# Altium project Button-Board.PrjPcb
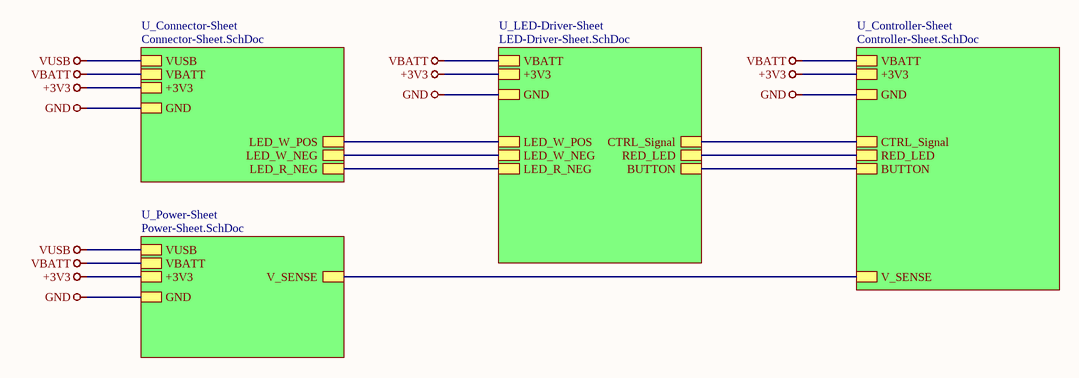
[diagram p0: Top-Sheet.SchDoc]
5 sheets, 41 parts. Net scope: hierarchical (ports join the sheet entries above them; power ports are global).
Board file: PCB_Button_Board.PcbDoc
Sheets:
  Top-Sheet.SchDoc
    U_Connector-Sheet = Connector-Sheet.SchDoc
    U_Controller-Sheet = Controller-Sheet.SchDoc
    U_LED-Driver-Sheet = LED-Driver-Sheet.SchDoc
    U_Power-Sheet = Power-Sheet.SchDoc

## Sheet Top-Sheet.SchDoc
size A; DocumentNumber: 1; SheetNumber: 1; SheetTotal: 5

### Sub-sheets
U_Connector-Sheet = Connector-Sheet.SchDoc: VUSB, LED_W_POS, LED_W_NEG, LED_R_NEG, GND, +3V3, VBATT
U_Controller-Sheet = Controller-Sheet.SchDoc: GND, +3V3, RED_LED, CTRL_Signal, BUTTON, VBATT, V_SENSE
U_LED-Driver-Sheet = LED-Driver-Sheet.SchDoc: GND, +3V3, RED_LED, CTRL_Signal, BUTTON, VBATT, LED_W_POS, LED_W_NEG, LED_R_NEG
U_Power-Sheet = Power-Sheet.SchDoc: GND, +3V3, VUSB, VBATT, V_SENSE

### Nets
+3V3: sheet U_Connector-Sheet/+3V3, sheet U_Controller-Sheet/+3V3, sheet U_LED-Driver-Sheet/+3V3, sheet U_Power-Sheet/+3V3
GND: sheet U_Connector-Sheet/GND, sheet U_Controller-Sheet/GND, sheet U_LED-Driver-Sheet/GND, sheet U_Power-Sheet/GND
VBATT: sheet U_Connector-Sheet/VBATT, sheet U_Controller-Sheet/VBATT, sheet U_LED-Driver-Sheet/VBATT, sheet U_Power-Sheet/VBATT
VUSB: sheet U_Connector-Sheet/VUSB, sheet U_Power-Sheet/VUSB
BUTTON: sheet U_Controller-Sheet/BUTTON, sheet U_LED-Driver-Sheet/BUTTON
CTRL_Signal: sheet U_Controller-Sheet/CTRL_Signal, sheet U_LED-Driver-Sheet/CTRL_Signal
LED_R_NEG: sheet U_Connector-Sheet/LED_R_NEG, sheet U_LED-Driver-Sheet/LED_R_NEG
LED_W_NEG: sheet U_Connector-Sheet/LED_W_NEG, sheet U_LED-Driver-Sheet/LED_W_NEG
LED_W_POS: sheet U_Connector-Sheet/LED_W_POS, sheet U_LED-Driver-Sheet/LED_W_POS
RED_LED: sheet U_Controller-Sheet/RED_LED, sheet U_LED-Driver-Sheet/RED_LED
V_SENSE: sheet U_Controller-Sheet/V_SENSE, sheet U_Power-Sheet/V_SENSE

## Sheet Connector-Sheet.SchDoc
size A; DocumentNumber: 5; SheetNumber: 5; SheetTotal: 5
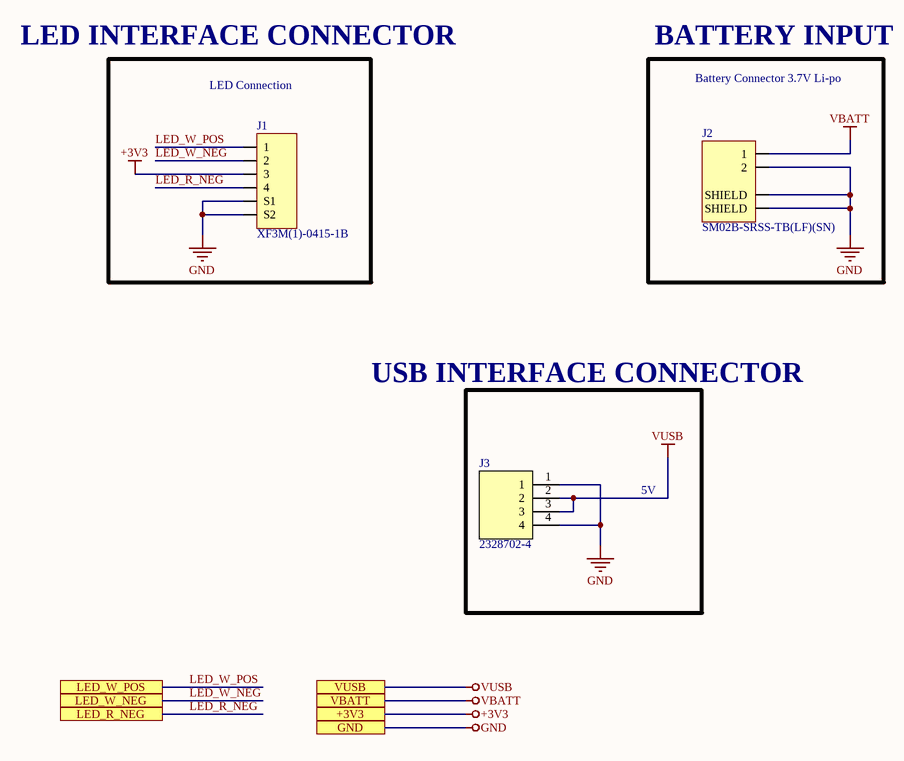
[diagram p1: Connector-Sheet.SchDoc]

### Parts
J1  XF3M(1)-0415-1B  [XF3M(1)-0415-1B]
J2  SM02B-SRSS-TB(LF)(SN)  [SM02B-SRSS-TB(LF)(SN)]
J3  2328702-4  [TE_2328702-4]

### Blocks framed on the sheet
LED Connection: J1
BATTERY INPUT: J2
5V: J3

### Ports
+3V3 (see Top-Sheet[1A], Controller-Sheet[2D], LED-Driver-Sheet[2D], Power-Sheet[2D]), GND (see Top-Sheet[1B], Controller-Sheet[2D], LED-Driver-Sheet[2D], Power-Sheet[2D]), LED_R_NEG (see Top-Sheet[2B], LED-Driver-Sheet[1D]), LED_W_NEG (see Top-Sheet[2B], LED-Driver-Sheet[1D]), LED_W_POS (see Top-Sheet[2B], LED-Driver-Sheet[1D]), VBATT (see Top-Sheet[1A], Controller-Sheet[2D], LED-Driver-Sheet[2D], Power-Sheet[2D]), VUSB (see Top-Sheet[1A], Power-Sheet[2D])

### Nets
+3V3: J1.3 ; port +3V3
GND: J1.S1 J1.S2 J2.2 J2.3(SHIELD) J2.4(SHIELD) J3.1 J3.4 ; port GND
VBATT: J2.1 ; port VBATT
VUSB: J3.2 J3.3 ; port VUSB
LED_R_NEG: J1.4 ; port LED_R_NEG
LED_W_NEG: J1.2 ; port LED_W_NEG
LED_W_POS: J1.1 ; port LED_W_POS

### Notes on the sheet
- LED INTERFACE CONNECTOR
- Battery Connector 3.7V Li-po
- USB INTERFACE CONNECTOR

### Library data of the parts
J1 = XF3M(1)-0415-1B: 4 Position FFC, FPC Connector Contacts, Top and Bottom 0.039" (1.00mm) Surface Mount, Right Angle; Manufacturer: Omron Electronics Inc-EMC Div; Item Type: FPC-1mm; Manufacturer Part Number: XF3M(1)-0415-1B; Digikey Part Number: OR1210CT-ND; ComponentLink1Description: Digikey Link; ComponentLink1URL: https://www.digikey.com/en/products/detail/omron-electronics-inc-emc-div/XF3M-1-0415-1B/4695932; Package: 1mm FPC
J2 = SM02B-SRSS-TB(LF)(SN): Connector Header Surface Mount, Right Angle 2 position 0.039 _1.00mm_; Manufacturer Part NUmber: SM02B-SRSS-TB_LF__SN_; Manufacturer: JST Sales; SnapEDA_Link: https://www.snapeda.com/parts/SM02B-SRSS-TB%28LF%29%28SN%29/JST%20Sales%20America%20Inc./view-part/447499/?ref=snap; Price: None; Value: *; Availability: Unavailable; Package: None; Digikey Part Number: 455-SM02B-SRSS-TBDKR-ND; ComponentLink1Description: Digikey Link; ComponentLink1URL: https://www.digikey.com/en/products/detail/jst-sales-america-inc/SM02B-SRSS-TB/926708?s=N4IgTCBcDaIMoFkAMYBCBaOAlOd0BVUQBdAXyA
J3 = 2328702-4: 4 Position FPC Connector Contacts, Top and Bottom 0.020 (0.50mm) Surface Mount, Right Angle; MF: TE Connectivity AMP Connectors; Package: None; Price: None; Check_prices: https://www.snapeda.com/parts/2328702-4/TE+Connectivity/view-part/?ref=eda; Value: *; SnapEDA_Link: https://www.snapeda.com/parts/2328702-4/TE+Connectivity/view-part/?ref=snap; MP: 2328702-4; Availability: In Stock; Purchase-URL: https://pricing.snapeda.com/search?q=2328702-4&ref=eda

## Sheet Controller-Sheet.SchDoc
size A; DocumentNumber: 3; SheetNumber: 3; SheetTotal: 5
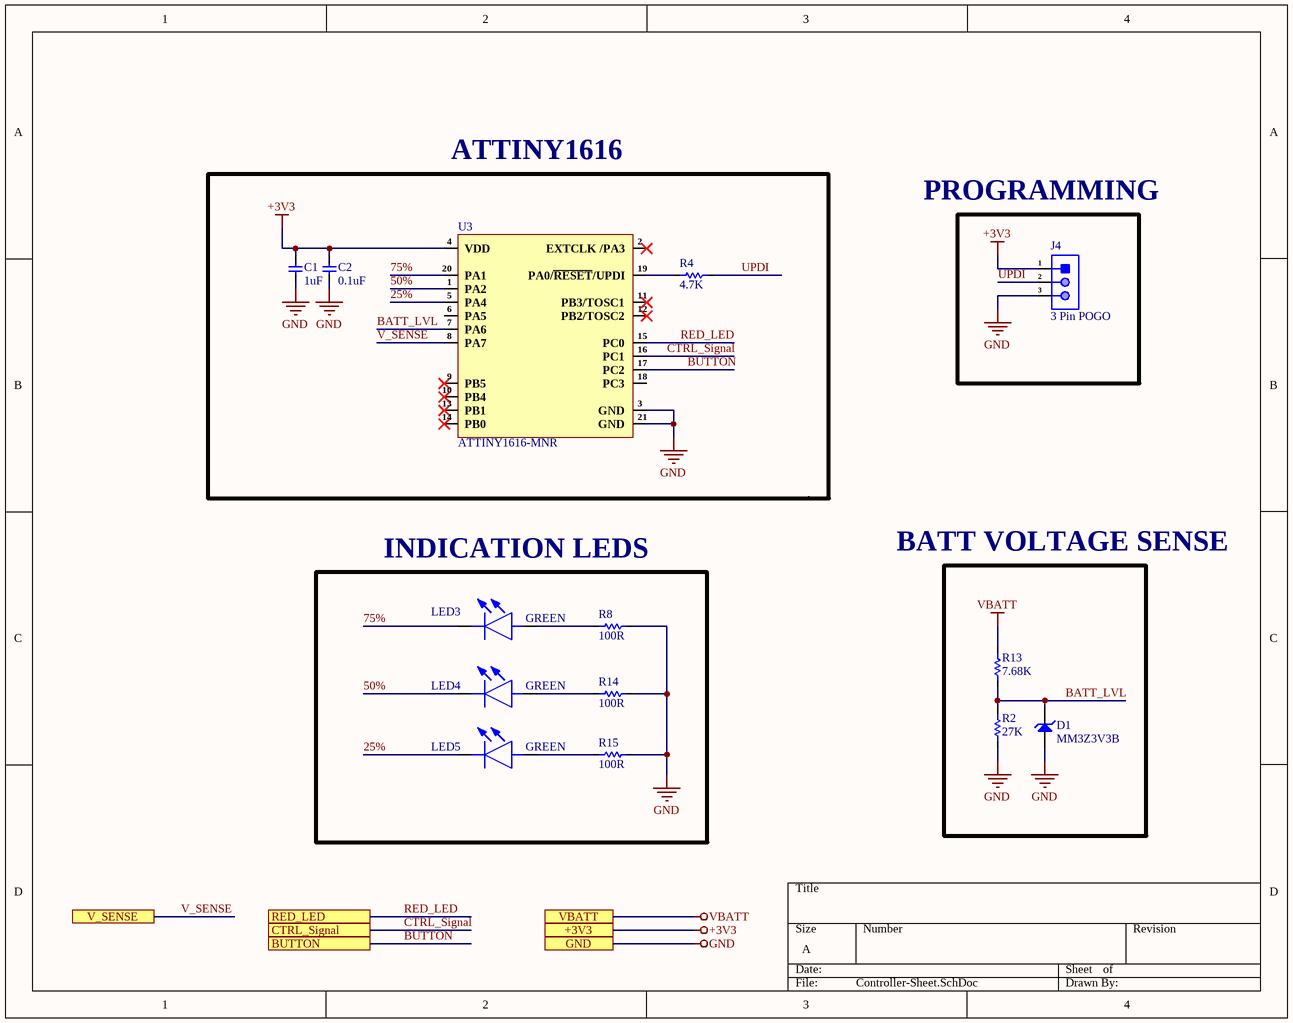
[diagram p2: Controller-Sheet.SchDoc]

### Parts
C1  1uF  [Cap-0402]
C2  0.1uF  [Cap-0402]
D1  MM3Z3V3B  [SOD323F]
J4  3 Pin POGO  [3 Pin POGO]
LED3  GREEN  [150060GS75000]
LED4  GREEN  [150060GS75000]
LED5  GREEN  [150060GS75000]
R2  27K  [Res-0402]
R4  4.7K  [Res-0402]
R8  100R  [Res-0402]
R13  7.68K  [Res-0402]
R14  100R  [Res-0402]
R15  100R  [Res-0402]
U3  ATTINY1616-MNR  [20-VQFN (3x3)]

### Blocks framed on the sheet
INDICATION LEDS: LED3-LED5 R8 R14 R15

### Ports
+3V3 (see Top-Sheet[3A], Connector-Sheet[2D], LED-Driver-Sheet[2D], Power-Sheet[2D]), BUTTON (see Top-Sheet[3B], LED-Driver-Sheet[1D]), CTRL_Signal (see Top-Sheet[3B], LED-Driver-Sheet[1D]), GND (see Top-Sheet[3A], Connector-Sheet[2D], LED-Driver-Sheet[2D], Power-Sheet[2D]), RED_LED (see Top-Sheet[3B], LED-Driver-Sheet[1D]), V_SENSE (see Top-Sheet[3B], Power-Sheet[1D]), VBATT (see Top-Sheet[3A], Connector-Sheet[2D], LED-Driver-Sheet[2D], Power-Sheet[2D])

### Nets
+3V3: C1.2 C2.2 J4.1 U3.4(VDD) ; port +3V3
GND: C1.1 C2.1 D1.1(A) J4.3 R2.1 R8.2 R14.2 R15.2 U3.3(GND) U3.21(GND) ; port GND
VBATT: R13.2 ; port VBATT
25%: LED5.1 U3.5(PA4)
50%: LED4.1 U3.1(PA2)
75%: LED3.1 U3.20(PA1)
BATT_LVL: D1.2(K) R2.2 R13.1 U3.7(PA6)
BUTTON: U3.17(PC2) ; port BUTTON
CTRL_Signal: U3.16(PC1) ; port CTRL_Signal
RED_LED: U3.15(PC0) ; port RED_LED
UPDI: J4.2 R4.2
V_SENSE: U3.8(PA7) ; port V_SENSE
NetLED3_2: LED3.2 R8.1
NetLED4_2: LED4.2 R14.1
NetLED5_2: LED5.2 R15.1
NetR4_1: R4.1 U3.19(PA0/~{RESET}/UPDI)

Not connected (* = marked no-connect by the designer): U3 2(EXTCLK_/PA3)* 6(PA5) 9(PB5)* 10(PB4)* 11(PB3/TOSC1)* 12(PB2/TOSC2)* 13(PB1)* 14(PB0)* 18(PC3)

### Notes on the sheet
- ATTINY1616
- PROGRAMMING
- BATT VOLTAGE SENSE

### Library data of the parts
C1 = GRM033R60J105MEA2D: 1 µF ±20% 6.3V Ceramic Capacitor X5R 0201 (0603 Metric); Manufacturer: Murata Electronics; Manufacturer Part Number: GRM033R60J105MEA2D; Digikey Part Number: 490-7229-6-ND; Item Type: Capacitor; Package: 0201; ComponentLink1Description: Digikey Link; ComponentLink1URL: https://www.digikey.com/en/products/detail/murata-electronics/GRM033R60J105MEA2D/4213369
C2 = GRM155R71C104KA88J: 0.1 µF ±10% 16V Ceramic Capacitor X7R 0402 (1005 Metric); Manufacturer: Murata Electronics; Manufacturer Part Number: GRM155R71C104KA88J; Digikey Part Number: 490-6328-6-ND; Item Type: Capacitor; Package: 0402; ComponentLink1Description: Digikey Link; ComponentLink1URL: https://www.digikey.com/en/products/detail/murata-electronics/GRM155R71C104KA88J/2610892
D1 = MM3Z3V3B: DIODE ZENER 3.3V 200MW SOD323F; Manufacturer: ON Semiconductor / Fairchild; Forward Voltage: 1V; Tolerance: 2%; Impedance: 89R; Max Reverse Leakage Current: 4.5uA; Test Current: 5mA; Element Configuration: Single; Supplier 1: Digi-Key; Manufacturer Part Number: MM3Z3V3B; Stock 1: 473644; Pricing 1: 1=0.22, 10=0.18, 100=0.0956, 500=0.06288, 1000=0.04276 (USD); Mount: Surface Mount; Number of Pins: 2; Weight: 0.0276g; Min Operating Temperature: -65°C; Max Operating Temperature: 150°C; Packaging: Tape and Reel; Package Quantity: 1; Max Power Dissipation: 200mW; Zener Voltage: 3.3V; Voltage Tolerance: 2%; Power Dissipation: 200mW; Working Voltage: 3.3V; Peak Reverse Current: 4.5uA; Length: 1.3mm; Height: 1mm; Width: 1.7mm; Radiation Hardening: No; REACH SVHC: No SVHC; Lead Free: Lead Free; ComponentLink1URL: http://www.onsemi.com/pub/Collateral/MM3Z9V1B-D.pdf?src-supplier=Digi-Key; ComponentLink1Description: http://www.onsemi.com/pub/Collateral/MM3Z9V1B-D.pdf?src-supplier=Digi-Key; ComponentLink2URL: http://www.mouser.com/ds/2/149/MM3Z3V3B-187166.pdf?src-supplier=Mouser; ComponentLink2Description: http://www.mouser.com/ds/2/149/MM3Z3V3B-187166.pdf?src-supplier=Mouser; ComponentLink3URL: https://www.fairchildsemi.com/datasheets/MM/MM3Z9V1B.pdf?src-supplier=Avnet; ComponentLink3Description: https://www.fairchildsemi.com/datasheets/MM/MM3Z9V1B.pdf?src-supplier=Avnet; ComponentLink4URL: http://www.farnell.com/datasheets/1706525.pdf?src-supplier=Element14; ComponentLink4Description: http://www.farnell.com/datasheets/1706525.pdf?src-supplier=Element14; Supplier Part Number 1: MM3Z3V3BCT-ND; Digikey Part Number: MM3Z3V3BDKR-ND; Item Type: Diode; ComponentLink5Description: Digikey Link; ComponentLink5URL: https://www.digikey.com/en/products/detail/onsemi/MM3Z3V3B/1626765?s=N4IgTCBcDaILJwMwC1EDVECEQF0C%2BQA
J4 = 68000-103HLF: CONN HEADER VERT 3POS 2.54MM; Item Type: Male Header; Number of Positions: 3; Current Rating: 3A; Insulation Resistance: 5GR; Voltage Rating: 1.5kV; Contact Post Length: 2.41mm; LCSC Part Number: C168677; ComponentLink1Description: LCSC; Supplier: Avnet; Supplier Part Number: 88K1775; RoHS: No; Category: Headers and Wire Housings; Stock: 2805; Pricing: 1=0.395, 10=0.31, 25=0.29, 50=0.27, 100=0.25 (USD); Contact Plating: Gold,GXT; Contact Material: Bronze; Housing Material: Thermoplastic; Housing Color: Black; Min Operating Temperature: -65°C; Max Operating Temperature: 125°C; Number of Rows: 1; Termination: Through Hole; Packaging: Bulk; Number of Contacts: 3; Contact Gender: Male; Orientation: Straight; Max Voltage Rating (AC): 1.5kV; Package Quantity: 100; Series: 68000; Length: 7.62mm; Pitch: 2.54mm; Contact Mating Length: 5.84mm; Depth: 2.41mm; Radiation Hardening: No; Flammability Rating: UL94 V-0; Reach SVHC Compliant: No; ComponentLink2URL: https://datasheet.ciiva.com/46392/1914865-46392021.pdf?src-supplier=Element14; ComponentLink2Description: https://datasheet.ciiva.com/46392/1914865-46392021.pdf?src-supplier=Element14; Digikey Part Number: 609-3461-ND; ComponentLink3Description: Digikey Link; ComponentLink3URL: https://www.digikey.com/en/products/detail/amphenol-cs-fci/68000-103HLF/2023309?s=N4IgTCBcDaIGwA4AMKC0BGJBmAEgGQDEQBdAXyA; Manufacturer Part Number: 68000-103HLF
LED3-LED5 = 150060GS75000: Green 520nm LED Indication - Discrete 3.2V 0603 (1608 Metric); Manufacturer: Würth Elektronik; Manufacturer Part Number: 150060GS75000; Supplier Part Number: 732-4971-6-ND; Item Type: LED; ComponentLink1Description: Digikey Link; ComponentLink1URL: https://www.digikey.com/en/products/detail/w%C3%BCrth-elektronik/150060GS75000/4489898; Package: 0603; Digikey Part Number: 732-4971-6-ND
R2 = RC0402FR-0727KL: 27 kOhms ±1% 0.063W, 1/16W Chip Resistor 0402 (1005 Metric) Moisture Resistant Thick Film; Manufacturer: YAGEO; Manufacturer Part Number: RC0402FR-0727KL; ComponentLink1Description: New link; ComponentLink1URL: *; Digikey Part Number: 311-27.0KLRDKR-ND; Item Type: Resistor; Package: 0402
R4 = RC0402FR-074K7L: 4.7 kOhms ±1% 0.063W, 1/16W Chip Resistor 0402 (1005 Metric) Moisture Resistant Thick Film; Manufacturer: YAGEO; Manufacturer Part Number: RC0402FR-074K7L; Digikey Part Number: 311-4.7KLRDKR-ND; Item Type: Resistor; Package: 0402; ComponentLink1Description: Digikey Link; ComponentLink1URL: https://www.digikey.com/en/products/detail/yageo/RC0402FR-074K7L/2827563
R8 R14 R15 = RC0402FR-07100RL: 100 Ohms ±1% 0.063W, 1/16W Chip Resistor 0402 (1005 Metric) Moisture Resistant Thick Film; Manufacturer: YAGEO; Manufacturer Part Number: RC0402FR-07100RL; Digikey Part Number: 311-100LRDKR-ND; Item Type: Resistor; Package: 0402; ComponentLink1Description: Digikey Link; ComponentLink1URL: https://www.digikey.com/en/products/detail/yageo/RC0402FR-07100RL/726527
R13 = AC0402FR-077K68L: 7.68 kOhms ±1% 0.063W, 1/16W Chip Resistor 0402 (1005 Metric) Automotive AEC-Q200, Moisture Resistant Thick Film; Manufacturer: YAGEO; Manufacturer Part Number: AC0402FR-077K68L; Digikey Part Number: YAG5688DKR-ND; Item Type: Resistor; Package: 0402; ComponentLink1Description: New link; ComponentLink1URL: *
U3 = ATTINY1616-MNR: AVR tinyAVR™ 1, Functional Safety (FuSa) Microcontroller IC 8-Bit 20MHz 16KB (16K x 8) FLASH 20-VQFN (3x3); Manufacturer: Microchip Tech; Manufacturer Part Number: ATTINY1616-MNR; Package: QFN-20-EP(3x3); Digikey Part Number: ATTINY1616-MNRDKR-ND; Item Type: IC; ComponentLink1URL: https://www.digikey.com/en/products/detail/microchip-technology/ATTINY1616-MNR/7354618?s=N4IgTCBcDaIIIBUEEkByBNAjANhwWgFlUAlEAXQF8g; ComponentLink1Description: Digikey Link

## Sheet LED-Driver-Sheet.SchDoc
size A; DocumentNumber: 4; SheetNumber: 4; SheetTotal: 5
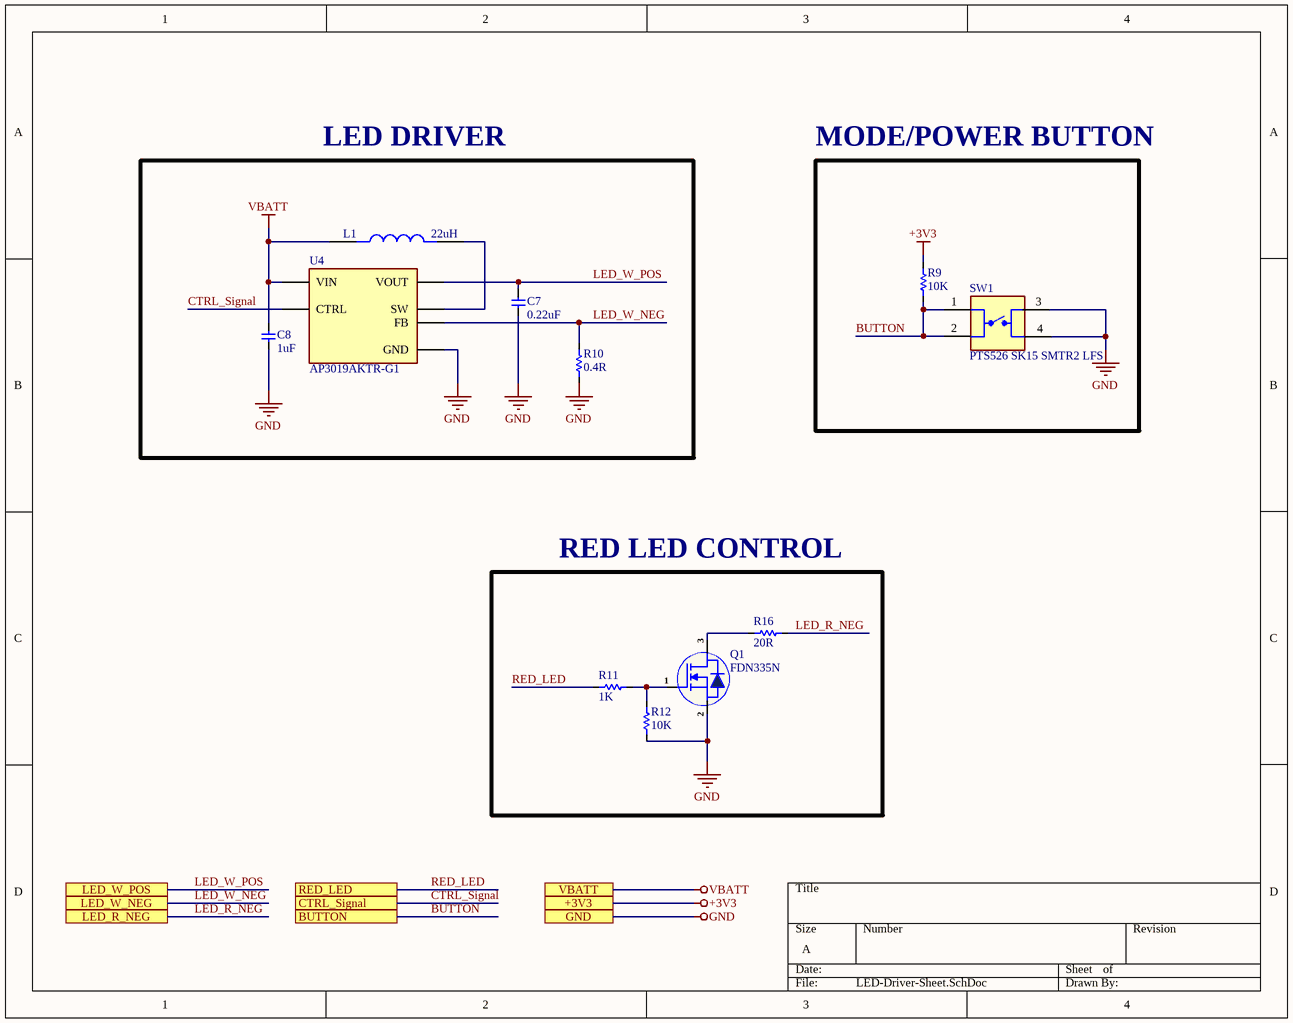
[diagram p3: LED-Driver-Sheet.SchDoc]

### Parts
C7  0.22uF  [Cap-0402]
C8  1uF  [Cap-0402]
L1  22uH  [IND_1235AS-H-220M=P3]
Q1  FDN335N  [SOT-23]
R9  10K  [Res-0402]
R10  0.4R  [Res-1206]
R11  1K  [Res-0402]
R12  10K  [Res-0402]
R16  20R  [RESC1005X40N]
SW1  PTS526 SK15 SMTR2 LFS  [PTS525SM15SMTR2LFS]
U4  AP3019AKTR-G1  [AP3019AKTR-G1]

### Blocks framed on the sheet
LED DRIVER: C7 C8 L1 R10 U4
MODE/POWER BUTTON: R9 SW1
RED LED CONTROL: Q1 R11 R12 R16

### Ports
+3V3 (see Top-Sheet[2A], Connector-Sheet[2D], Controller-Sheet[2D], Power-Sheet[2D]), BUTTON (see Top-Sheet[3B], Controller-Sheet[1D]), CTRL_Signal (see Top-Sheet[3B], Controller-Sheet[1D]), GND (see Top-Sheet[2A], Connector-Sheet[2D], Controller-Sheet[2D], Power-Sheet[2D]), LED_R_NEG (see Top-Sheet[2B], Connector-Sheet[1D]), LED_W_NEG (see Top-Sheet[2B], Connector-Sheet[1D]), LED_W_POS (see Top-Sheet[2B], Connector-Sheet[1D]), RED_LED (see Top-Sheet[3B], Controller-Sheet[1D]), VBATT (see Top-Sheet[2A], Connector-Sheet[2D], Controller-Sheet[2D], Power-Sheet[2D])

### Nets
+3V3: R9.1 ; port +3V3
GND: C7.1 C8.1 Q1.2(S) R10.1 R12.2 SW1.3 SW1.4 U4.2(GND) ; port GND
VBATT: C8.2 L1.1 U4.6(VIN) ; port VBATT
BUTTON: R9.2 SW1.1 SW1.2 ; port BUTTON
CTRL_Signal: U4.4(CTRL) ; port CTRL_Signal
LED_R_NEG: R16.2 ; port LED_R_NEG
LED_W_NEG: R10.2 U4.3(FB) ; port LED_W_NEG
LED_W_POS: C7.2 U4.5(VOUT) ; port LED_W_POS
RED_LED: R11.1 ; port RED_LED
NetL1_2: L1.2 U4.1(SW)
NetQ1_1: Q1.1(G) R11.2 R12.1
NetQ1_3: Q1.3(D) R16.1

### Library data of the parts
C7 = CC0402KRX5R8BB224: 0.22 µF ±10% 25V Ceramic Capacitor X5R 0402 (1005 Metric); Manufacturer: YAGEO; Manufacturer Part Number: CC0402KRX5R8BB224; Digikey Part Number: 311-3341-6-ND; Item Type: Capacitor; Package: 0402; ComponentLink1Description: Digikey Link; ComponentLink1URL: https://www.digikey.com/en/products/detail/yageo/CC0402KRX5R8BB224/5883337?s=N4IgTCBcDaIMJwAwBZFgNICUAaBWTAHAEJFhjIgC6AvkA
C8 = GRM033R60J105MEA2D: as C1 on sheet Controller-Sheet; Manufacturer Part Number: GRM033R60J105MEA2D; Digikey Part Number: 490-7229-6-ND; Item Type: Capacitor; Package: 0201; ComponentLink1Description: Digikey Link; ComponentLink1URL: https://www.digikey.com/en/products/detail/murata-electronics/GRM033R60J105MEA2D/4213369
L1 = 1235AS-H-220M=P3: Inductor Power Shielded Wirewound 22uH 20% 100KHz Ferrite 1A 0.306Ohm DCR 1818 T/R; Manufacturer: Murata Electronics; Package: None; Manufacturer Part Number: 1235AS-H-220M=P3; Digikey Part Number: 490-14209-6-ND; ComponentLink1Description: Digikey Link; ComponentLink1URL: https://www.digikey.com/en/products/detail/murata-electronics/1235AS-H-220M-P3/6205726; Item Type: Inductor
Q1 = FDN335N: SOT-23 MOSFETs ROHS; Manufacturer: onsemi; Item Type: Mosfet; Manufacturer Part Number: FDN335N; Package: SOT-23; Digikey Part Number: FDN335NDKR-ND; ComponentLink1Description: Digikey Link; ComponentLink1URL: https://www.digikey.com/en/products/detail/onsemi/FDN335N/965301
R9 R12 = RC0603FR-0710KL: 10 kOhms ±1% 0.063W, 1/16W Chip Resistor 0402 (1005 Metric) Moisture Resistant Thick Film; Manufacturer: YAGEO; Manufacturer Part Number: RC0402FR-0710KL; Digikey Part Number: 311-10.0KLRDKR-ND; Item Type: Resistor; Package: 0402; ComponentLink1Description: Digikey Link; ComponentLink1URL: https://www.digikey.com/en/products/detail/yageo/RC0402FR-0710KL/726523
R10 = RL1206FR-070R4L: 400 mOhms ±1% 0.25W, 1/4W Chip Resistor 1206 (3216 Metric) Automotive AEC-Q200, Current Sense, Moisture Resistant Thick Film; Manufacturer: YAGEO; Manufacturer Part Number: RL1206FR-070R4L; Digikey Part Number: 311-.4LWDKR-ND; Item Type: Resistor; Package: 1206; ComponentLink1Description: Digikey Link; ComponentLink1URL: https://www.digikey.com/en/products/detail/yageo/RL1206FR-070R4L/3886028
R11 = RC0402FR-071KL: 1 kOhms ±1% 0.063W, 1/16W Chip Resistor 0402 (1005 Metric) Moisture Resistant Thick Film; Manufacturer: YAGEO; Manufacturer Part Number: RC0402FR-071KL; Digikey Part Number: 311-1.00KLRDKR-ND; Item Type: Resistor; Package: 0402; ComponentLink1Description: Digikey Link; ComponentLink1URL: https://www.digikey.com/en/products/detail/yageo/RC0402FR-071KL/726513
R16 = RCS040220R0FKED: 20 Ohms ±1% 0.2W, 1/5W Chip Resistor 0402 (1005 Metric) Automotive AEC-Q200, Pulse Withstanding Thick Film; Manufacturer: Vishay Dale; Manufacturer Part Number: RCS040220R0FKED; Digikey Part Number: 541-RCS040220R0FKEDDKR-ND; Item Type: Resistor; Package: 0402; ComponentLink1Description: Digikey Link; ComponentLink1URL: https://www.digikey.com/en/products/detail/vishay-dale/RCS040220R0FKED/5867510
SW1 = MCSLPT4644B1PHTR: Tactile Switch SPST-NO Top Actuated Surface Mount; Manufacturer: TE Connectivity ALCOSWITCH Switches; Manufacturer Part Number: MCSLPT4644B1PHTR; Digikey Part Number: 450-3383-6-ND; Item Type: Switch; ComponentLink1Description: Digikey Link; ComponentLink1URL: https://www.digikey.com/en/products/detail/te-connectivity-alcoswitch-switches/MCSLPT4644B1PHTR/9686564; Package: SMD
U4 = AP3019AKTR-G1: LED Driver IC 1 Output DC DC Regulator Step-Up (Boost) PWM Dimming 550mA (Switch) SOT-23-6; Manufacturer: Diodes Incorporated; Manufacturer Part Number: AP3019AKTR-G1; ComponentLink1Description: Digikey Link; ComponentLink1URL: https://www.digikey.com/en/products/detail/diodes-incorporated/AP3019AKTR-G1/4470850?s=N4IgTCBcDaIIIAUDMAGAjATjgaQCoCUBaAcTRAF0BfIA; Supplier Part Number: AP3019AKTR-G1DIDKR-ND; Item Type: LED Driver; Package: SOT-23-6; Digikey Part Number: AP3019AKTR-G1DIDKR-ND

## Sheet Power-Sheet.SchDoc
size A; DocumentNumber: 2; SheetNumber: 2; SheetTotal: 5
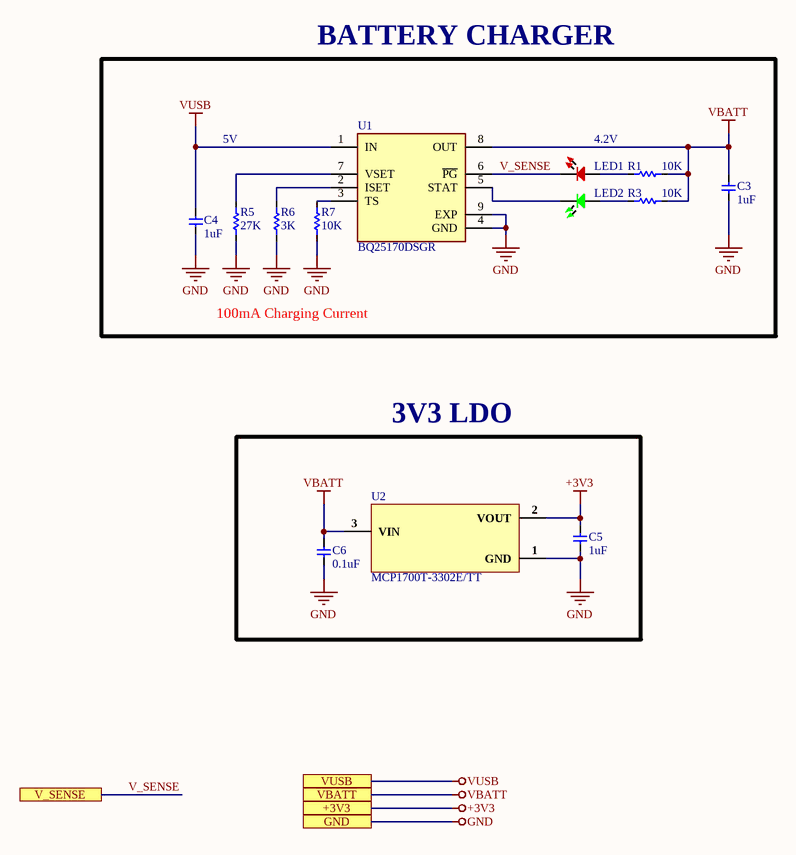
[diagram p4: Power-Sheet.SchDoc]

### Parts
C3  1uF  [Cap-0402]
C4  1uF  [Cap-0402]
C5  1uF  [Cap-0402]
C6  0.1uF  [Cap-0402]
LED1  RED  [LED-0603]  (value not drawn)  (no BOM)
LED2  Emerald  [LED-0603]  (value not drawn)  (no BOM)
R1  10K  [Res-0402]  (no BOM)
R3  10K  [Res-0402]  (no BOM)
R5  27K  [Res-0402]
R6  3K  [Res-0402]
R7  10K  [Res-0402]
U1  BQ25170DSGR  [BQ25170DSGR]
U2  MCP1700T-3302E/TT  [SOT-23]

### Blocks framed on the sheet
BATTERY CHARGER: C3 C4 LED1 LED2 R1 R3 R5-R7 U1
3V3 LDO: C5 C6 U2

### Ports
+3V3 (see Top-Sheet[1B], Connector-Sheet[2D], Controller-Sheet[2D], LED-Driver-Sheet[2D]), GND (see Top-Sheet[1B], Connector-Sheet[2D], Controller-Sheet[2D], LED-Driver-Sheet[2D]), V_SENSE (see Top-Sheet[2B], Controller-Sheet[1D]), VBATT (see Top-Sheet[1B], Connector-Sheet[2D], Controller-Sheet[2D], LED-Driver-Sheet[2D]), VUSB (see Top-Sheet[1B], Connector-Sheet[2D])

### Nets
+3V3: C5.2 U2.2(VOUT) ; port +3V3
GND: C3.1 C4.1 C5.1 C6.1 R5.1 R6.1 R7.1 U1.4(GND) U1.9(EXP) U2.1(GND) ; port GND
VBATT: C3.2 C6.2 R1.1 R3.1 U1.8(OUT) U2.3(VIN) ; port VBATT
VUSB: C4.2 U1.1(IN) ; port VUSB
V_SENSE: LED1.2 U1.6(~{PG}) ; port V_SENSE
NetLED1_1: LED1.1 R1.2
NetLED2_1: LED2.1 R3.2
NetLED2_2: LED2.2 U1.5(STAT)
NetR5_2: R5.2 U1.7(VSET)
NetR6_2: R6.2 U1.2(ISET)
NetR7_2: R7.2 U1.3(TS)

### Notes on the sheet
- 5V
- 4.2V
- 100mA Charging Current

### Library data of the parts
C3-C5 = GRM033R60J105MEA2D: as C1 on sheet Controller-Sheet; Manufacturer Part Number: GRM033R60J105MEA2D; Digikey Part Number: 490-7229-6-ND; Item Type: Capacitor; Package: 0201; ComponentLink1Description: Digikey Link; ComponentLink1URL: https://www.digikey.com/en/products/detail/murata-electronics/GRM033R60J105MEA2D/4213369
C6 = GRM155R71C104KA88J: as C2 on sheet Controller-Sheet; Manufacturer Part Number: GRM155R71C104KA88J; Digikey Part Number: 490-6328-6-ND; Item Type: Capacitor; Package: 0402; ComponentLink1Description: Digikey Link; ComponentLink1URL: https://www.digikey.com/en/products/detail/murata-electronics/GRM155R71C104KA88J/2610892
LED1 = NCD0603R3: RED LED 0603 Light Emitting Diodes; Manufacturer: Foshan NationStar Optoelectronics; Manufacturer Part Number: NCD0603R3; Package: 0603; Item Type: LED; LCSC Part Number: C3151730; ComponentLink1Description: LCSC; ComponentLink1URL: https://www.lcsc.com/product-detail/Light-Emitting-Diodes-LED_Foshan-NationStar-Optoelectronics-NCD0603R3_C3151730.html
LED2 = NCD0603G2: Emerald 0603 Light Emitting Diodes (LED) ROHS; Manufacturer: Foshan NationStar Optoelectronics; Manufacturer Part Number: NCD0603G2; Package: 0603; LCSC Part Number: C87326; Item Type: LED; ComponentLink1Description: LCSC; ComponentLink1URL: https://www.lcsc.com/product-detail/Light-Emitting-Diodes-LED_Foshan-NationStar-Optoelectronics-NCD0603G2_C87326.html
R1 R3 R7 = RC0603FR-0710KL: as R9 on sheet LED-Driver-Sheet; Digikey Part Number: 311-10.0KLRDKR-ND; Item Type: Resistor; Package: 0402; ComponentLink1Description: Digikey Link; ComponentLink1URL: https://www.digikey.com/en/products/detail/yageo/RC0402FR-0710KL/726523
R5 = RC0402FR-0727KL: as R2 on sheet Controller-Sheet; Manufacturer Part Number: RC0402FR-0727KL; ComponentLink1Description: New link; ComponentLink1URL: *; Digikey Part Number: 311-27.0KLRDKR-ND; Item Type: Resistor; Package: 0402
R6 = RC0402FR-073KL: 3 kOhms ±1% 0.063W, 1/16W Chip Resistor 0402 (1005 Metric) Moisture Resistant Thick Film; Manufacturer: YAGEO; Manufacturer Part Number: RC0402FR-073KL; Digikey Part Number: 311-3KLRCT-ND; Item Type: Resistor; Package: 0402; ComponentLink1Description: Digikey Link; ComponentLink1URL: https://www.digikey.com/en/products/detail/yageo/RC0402FR-073KL/2827586
U1 = BQ25170DSGR: Charger IC Multi-Chemistry 8-WSON (2x2); Manufacturer: Texas Instruments; Item Type: BATTERY CHARGER; Manufacturer Part Number: BQ25170DSGR; Digikey Part Number: 296-BQ25170DSGRDKR-ND; Package: 8-WFDFN Exposed Pad; ComponentLink1Description: Digikey Link; ComponentLink1URL: https://www.digikey.com/en/products/detail/texas-instruments/BQ25170DSGR/14124032
U2 = MCP1700T-3302E/TT: IC REG LDO 3.3V 0.25A SOT23-3; Manufacturer: Microchip; Number of Outputs: 1; Min Input Voltage: 2.3V; Max Input Voltage: 6V; Dropout Voltage: 178mV; Output Current: 250mA; Max Power Dissipation: 369.6mW; Input Bias Current: 1.6uA; Polarity: Positive; Quiescent Current: 4uA; Accuracy: 2%; Output Type: Fixed; Supplier 1: Digi-Key; Manufacturer Part Number: MCP1700T-3302E/TT; RoHS: Yes; Category: Voltage Regulators - Linear; Stock 1: 230029; Pricing 1: 1=0.50000, 25=0.42400, 100=0.37500 (USD); Mount: Surface Mount; Case/Package: SOT-23; Number of Pins: 3; Contact Plating: Tin,Matte; Min Operating Temperature: -40°C; Max Operating Temperature: 125°C; Nominal Output Voltage: 3.3V; Packaging: Tape and Reel; Output Voltage: 3.3V; Max Output Current: 250mA; Max Supply Voltage: 6V; Min Supply Voltage: 2.3V; Package Quantity: 3000; Min Output Voltage: 3.3V; Max Output Voltage: 3.3V; Termination: SMD/SMT; Output Voltage Accuracy: 2%; Nominal Supply Current: 4uA; Power Dissipation: 369.6mW; Supply Current: 4uA; Length: 2.9mm; Width: 1.3mm; Height: 0.95mm; Radiation Hardening: No; Reach SVHC Compliant: No SVHC; Lead Free: Lead Free; RoHS Compliant: Yes; ComponentLink1URL: https://datasheet.ciiva.com/5801/1784514-5801824.pdf?src-supplier=Farnell; ComponentLink1Description: https://datasheet.ciiva.com/5801/1784514-5801824.pdf?src-supplier=Farnell; ComponentLink2URL: https://datasheet.ciiva.com/2040/21826b-2040112.pdf?src-supplier=Digi-Key; ComponentLink2Description: https://datasheet.ciiva.com/2040/21826b-2040112.pdf?src-supplier=Digi-Key; ComponentLink3URL: https://datasheet.ciiva.com/7649/1784514-7649813.pdf?src-supplier=Element14; ComponentLink3Description: https://datasheet.ciiva.com/7649/1784514-7649813.pdf?src-supplier=Element14; ComponentLink4URL: https://datasheet.ciiva.com/22710/1784514-22710988.pdf?src-supplier=Element14; ComponentLink4Description: https://datasheet.ciiva.com/22710/1784514-22710988.pdf?src-supplier=Element14; ComponentLink5URL: https://datasheet.ciiva.com/14150/mcp1700-eng-tds-14150122.pdf?src-supplier=Distrelec; ComponentLink5Description: https://datasheet.ciiva.com/14150/mcp1700-eng-tds-14150122.pdf?src-supplier=Distrelec; ComponentLink6URL: https://datasheet.ciiva.com/8041/1784514-8041598.pdf?src-supplier=Element14; ComponentLink6Description: https://datasheet.ciiva.com/8041/1784514-8041598.pdf?src-supplier=Element14; ComponentLink7URL: https://datasheet.ciiva.com/3224/jp011779-3224133.pdf?src-supplier=Avnet; ComponentLink7Description: https://datasheet.ciiva.com/3224/jp011779-3224133.pdf?src-supplier=Avnet; ComponentLink8URL: https://datasheet.ciiva.com/16208/filehandler-aspxddocname-en011779-16208911.pdf?src-supplier=Future+Electronics; ComponentLink8Description: https://datasheet.ciiva.com/16208/filehandler-aspxddocname-en011779-16208911.pdf?src-supplier=Future+Electronics; ComponentLink9URL: https://datasheet.ciiva.com/15200/getdatasheetpartid-453599-15200229.pdf?src-supplier=Verical; ComponentLink9Description: https://datasheet.ciiva.com/15200/getdatasheetpartid-453599-15200229.pdf?src-supplier=Verical; ComponentLink10URL: https://datasheet.ciiva.com/2040/21826b-2040113.pdf?src-supplier=Digi-Key; ComponentLink10Description: https://datasheet.ciiva.com/2040/21826b-2040113.pdf?src-supplier=Digi-Key; ComponentLink11URL: https://datasheet.ciiva.com/2040/21826b-2040114.pdf?src-supplier=Digi-Key; ComponentLink11Description: https://datasheet.ciiva.com/2040/21826b-2040114.pdf?src-supplier=Digi-Key; ComponentLink12URL: https://datasheet.ciiva.com/29305/651414-da-01-en-ic-reg-ld-mcp1700t-3302e-tt-sot-23-3-mcp-29305258.pdf?src-supplier=Conrad; ComponentLink12Description: https://datasheet.ciiva.com/29305/651414-da-01-en-ic-reg-ld-mcp1700t-3302e-tt-sot-23-3-mcp-29305258.pdf?src-supplier=Conrad; Supplier Part Number 1: MCP1700T3302ETTCT-ND; Item Type: IC; Digikey Part Number: MCP1700T3302ETTDKR-ND

## Nets that join several sheets
+3V3: Connector-Sheet (J1.3), Controller-Sheet (C1.2 C2.2 J4.1 U3.4), LED-Driver-Sheet (R9.1), Power-Sheet (C5.2 U2.2)
GND: Connector-Sheet (7 pins), Controller-Sheet (10 pins), LED-Driver-Sheet (8 pins), Power-Sheet (10 pins)
VBATT: Connector-Sheet (J2.1), Controller-Sheet (R13.2), LED-Driver-Sheet (C8.2 L1.1 U4.6), Power-Sheet (6 pins)
VUSB: Connector-Sheet (J3.2 J3.3), Power-Sheet (C4.2 U1.1)
BUTTON: Controller-Sheet (U3.17), LED-Driver-Sheet (R9.2 SW1.1 SW1.2)
CTRL_Signal: Controller-Sheet (U3.16), LED-Driver-Sheet (U4.4)
LED_R_NEG: Connector-Sheet (J1.4), LED-Driver-Sheet (R16.2)
LED_W_NEG: Connector-Sheet (J1.2), LED-Driver-Sheet (R10.2 U4.3)
LED_W_POS: Connector-Sheet (J1.1), LED-Driver-Sheet (C7.2 U4.5)
RED_LED: Controller-Sheet (U3.15), LED-Driver-Sheet (R11.1)
V_SENSE: Controller-Sheet (U3.8), Power-Sheet (LED1.2 U1.6)